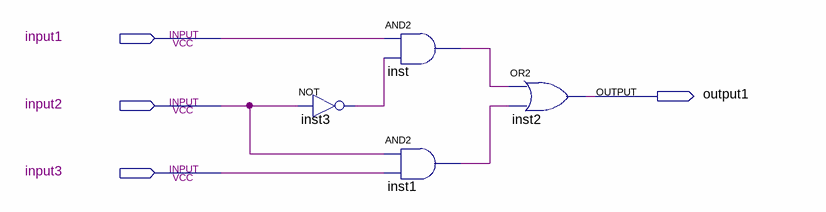
[diagram p0: schematic sheet]
// Quartus schematic choosefrom2.bdf as structural Verilog: 4 symbols, 4 pins
module choosefrom2 (
  input  input1,
  input  input2,
  input  input3,
  output output1
);

  wire inst1_out, inst3_out, inst_out;

  not inst3 (inst3_out, input2);
  and inst (inst_out, input1, inst3_out);
  and inst1 (inst1_out, input2, input3);
  or inst2 (output1, inst_out, inst1_out);
endmodule
